# Altium schematic sheet EthernetIN.SchDoc
size A4
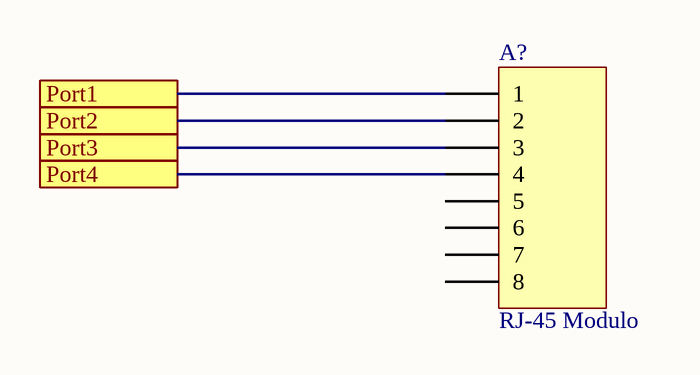
[diagram p0: EthernetIN.SchDoc]

## Parts
A?  RJ-45 Modulo  [RJ45_RJHSE5E80]

## Ports
Port1, Port2, Port3, Port4

## Nets
Port1: A?.1 ; port Port1
Port2: A?.2 ; port Port2
Port3: A?.3 ; port Port3
Port4: A?.4 ; port Port4

Not connected (* = marked no-connect by the designer): A? 5 6 7 8

## Library data of the parts
A? = RJ45_RJHSE5E80: Modulo RJ-45 RJHSE5E80; Manufacturer Part-Number: 1-338088-3; Manufacturer: Amphenol Commercial; Shielding: Shielded; Connector Type: Jack; Number of Ports: 1; Direction: Up; Gender: Female; Current Rating: 1.5A; Voltage Rating: 125V; Number of Positions: 8; Insulation Resistance: 500MR; Pitch: 2.03mm; LatestRevisionDate: 17-Jul-2002; LatestRevisionNote: Re-released for DXP Platform.; Publisher: Altium Limited; Digikey Part-Number: A99306CT-ND; Supplier 1: Digi-Key; Manufacturer Part Number: RJHSE5E80; Stock 1: 16396; Pricing 1: 1=1.28, 10=1.125, 25=1.0584, 50=1.0144, 100=0.9702, 250=0.882, 500=0.7938, 1000=0.7056, 2500=0.63945 (USD); Mount: Through Hole; Contact Plating: Gold; Contact Material: Bronze; Housing Material: Thermoplastic; Color: Black; Min Operating Temperature: -55°C; Max Operating Temperature: 85°C; Packaging: Tray; Termination: Solder; Number of Rows: 1; Package Quantity: 120; Number of Contacts: 8; Orientation: Right Angle; Flammability Rating: UL94 V-0; ComponentLink1URL: http://www.mouser.com/ds/2/18/Amphenol_RJHSE_BRO-311217.pdf?src-supplier=Mouser; ComponentLink1Description: http://www.mouser.com/ds/2/18/Amphenol_RJHSE_BRO-311217.pdf?src-supplier=Mouser; ComponentLink2URL: https://media.digikey.com/pdf/Data%20Sheets/Amphenol%20PDFs/RJHSE5E8x_Dwg.pdf?src-supplier=Digi-Key; ComponentLink2Description: https://media.digikey.com/pdf/Data%20Sheets/Amphenol%20PDFs/RJHSE5E8x_Dwg.pdf?src-supplier=Digi-Key; Supplier Part Number 1: RJHSE5E80-ND